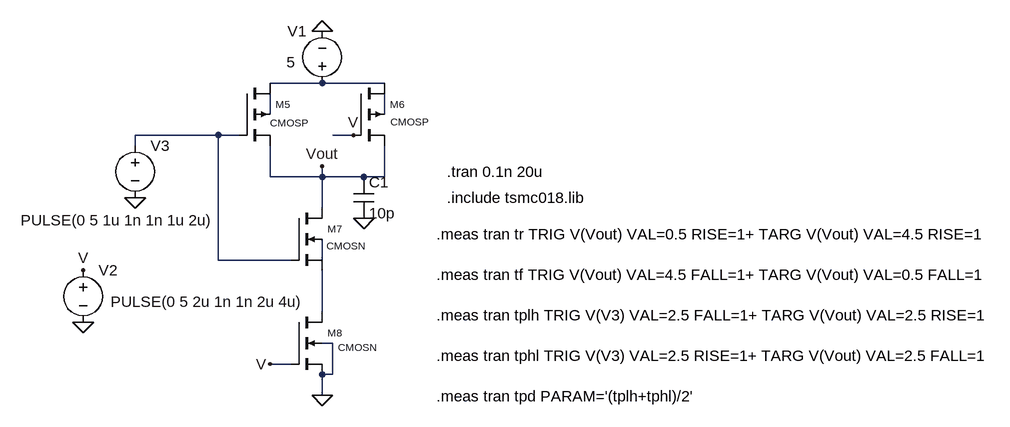
[diagram p0: schematic NAND.asc]
NAND.asc, the LTspice schematic file:
Version 4
SHEET 1 1552 680
WIRE 160 64 80 64
WIRE 256 64 160 64
WIRE 80 112 80 80
WIRE 256 112 256 80
WIRE 0 144 -128 144
WIRE 32 144 0 144
WIRE 208 144 176 144
WIRE -128 160 -128 144
WIRE 80 208 80 160
WIRE 160 208 160 192
WIRE 160 208 80 208
WIRE 224 208 160 208
WIRE 256 208 256 160
WIRE 256 208 224 208
WIRE 160 256 160 208
WIRE 0 336 0 144
WIRE 112 336 0 336
WIRE 160 336 160 304
WIRE 160 416 160 352
WIRE 176 464 160 464
WIRE 112 496 80 496
WIRE 176 512 176 464
WIRE 176 512 160 512
WIRE 160 544 160 512
FLAG 160 -16 0
FLAG 80 496 V
FLAG -128 240 0
FLAG -208 432 0
FLAG 160 192 Vout
FLAG 160 544 0
FLAG -208 352 V
FLAG 208 144 V
FLAG 224 272 0
SYMBOL voltage 160 80 R180
WINDOW 0 24 96 Left 2
WINDOW 3 41 48 Left 2
SYMATTR InstName V1
SYMATTR Value 5
SYMBOL voltage -128 144 R0
WINDOW 123 0 0 Left 0
WINDOW 39 0 0 Left 0
WINDOW 3 -176 131 Left 2
SYMATTR InstName V3
SYMATTR Value PULSE(0 5 1u 1n 1n 1u 2u)
SYMBOL voltage -208 336 R0
WINDOW 123 0 0 Left 0
WINDOW 39 0 0 Left 0
WINDOW 3 42 64 Left 2
SYMATTR InstName V2
SYMATTR Value PULSE(0 5 2u 1n 1n 2u 4u)
SYMBOL pmos4 32 64 R0
WINDOW 0 56 32 Left 1
WINDOW 3 48 61 Left 1
SYMATTR InstName M5
SYMATTR Value CMOSP
SYMATTR Value2 l=0.18u
SYMBOL pmos4 208 64 R0
WINDOW 0 56 32 Left 1
WINDOW 3 57 59 Left 1
SYMATTR InstName M6
SYMATTR Value CMOSP
SYMATTR Value2 l=0.18u
SYMBOL nmos4 112 256 R0
WINDOW 0 56 32 Left 1
WINDOW 3 55 58 Left 1
SYMATTR InstName M7
SYMATTR Value CMOSN
SYMATTR Value2 l=0.18u
SYMBOL nmos4 112 416 R0
WINDOW 0 56 32 Left 1
WINDOW 3 72 54 Left 1
SYMATTR InstName M8
SYMATTR Value CMOSN
SYMATTR Value2 l=0.18u
SYMBOL cap 208 208 R0
SYMATTR InstName C1
SYMATTR Value 10p
TEXT 352 240 Left 2 !.include tsmc018.lib
TEXT 352 200 Left 2 !.tran 0.1n 20u
TEXT 336 296 Left 2 !.meas tran tr TRIG V(Vout) VAL=0.5 RISE=1+ TARG V(Vout) VAL=4.5 RISE=1\n \n.meas tran tf TRIG V(Vout) VAL=4.5 FALL=1+ TARG V(Vout) VAL=0.5 FALL=1\n \n.meas tran tplh TRIG V(V3) VAL=2.5 FALL=1+ TARG V(Vout) VAL=2.5 RISE=1\n \n.meas tran tphl TRIG V(V3) VAL=2.5 RISE=1+ TARG V(Vout) VAL=2.5 FALL=1\n \n.meas tran tpd PARAM='(tplh+tphl)/2'

The netlist it stands for:
* NAND.asc
V1 N001 0 5
V3 N004 0 PULSE(0 5 1u 1n 1n 1u 2u)
V2 V 0 PULSE(0 5 2u 1n 1n 2u 4u)
M5 N001 N004 Vout N002 CMOSP l=0.18u
M6 N001 V Vout N003 CMOSP l=0.18u
M7 Vout N004 N006 N005 CMOSN l=0.18u
M8 N006 V 0 0 CMOSN l=0.18u
C1 Vout 0 10p
.model NMOS NMOS
.model PMOS PMOS
.lib standard.mos
.include tsmc018.lib
.tran 0.1n 20u
.meas tran tr TRIG V(Vout) VAL=0.5 RISE=1+ TARG V(Vout) VAL=4.5 RISE=1
.meas tran tf TRIG V(Vout) VAL=4.5 FALL=1+ TARG V(Vout) VAL=0.5 FALL=1
.meas tran tplh TRIG V(V3) VAL=2.5 FALL=1+ TARG V(Vout) VAL=2.5 RISE=1
.meas tran tphl TRIG V(V3) VAL=2.5 RISE=1+ TARG V(Vout) VAL=2.5 FALL=1
.meas tran tpd PARAM='(tplh+tphl)/2'
.backanno
.end